# EAGLE design pannuhuone (EAGLE 5.06)
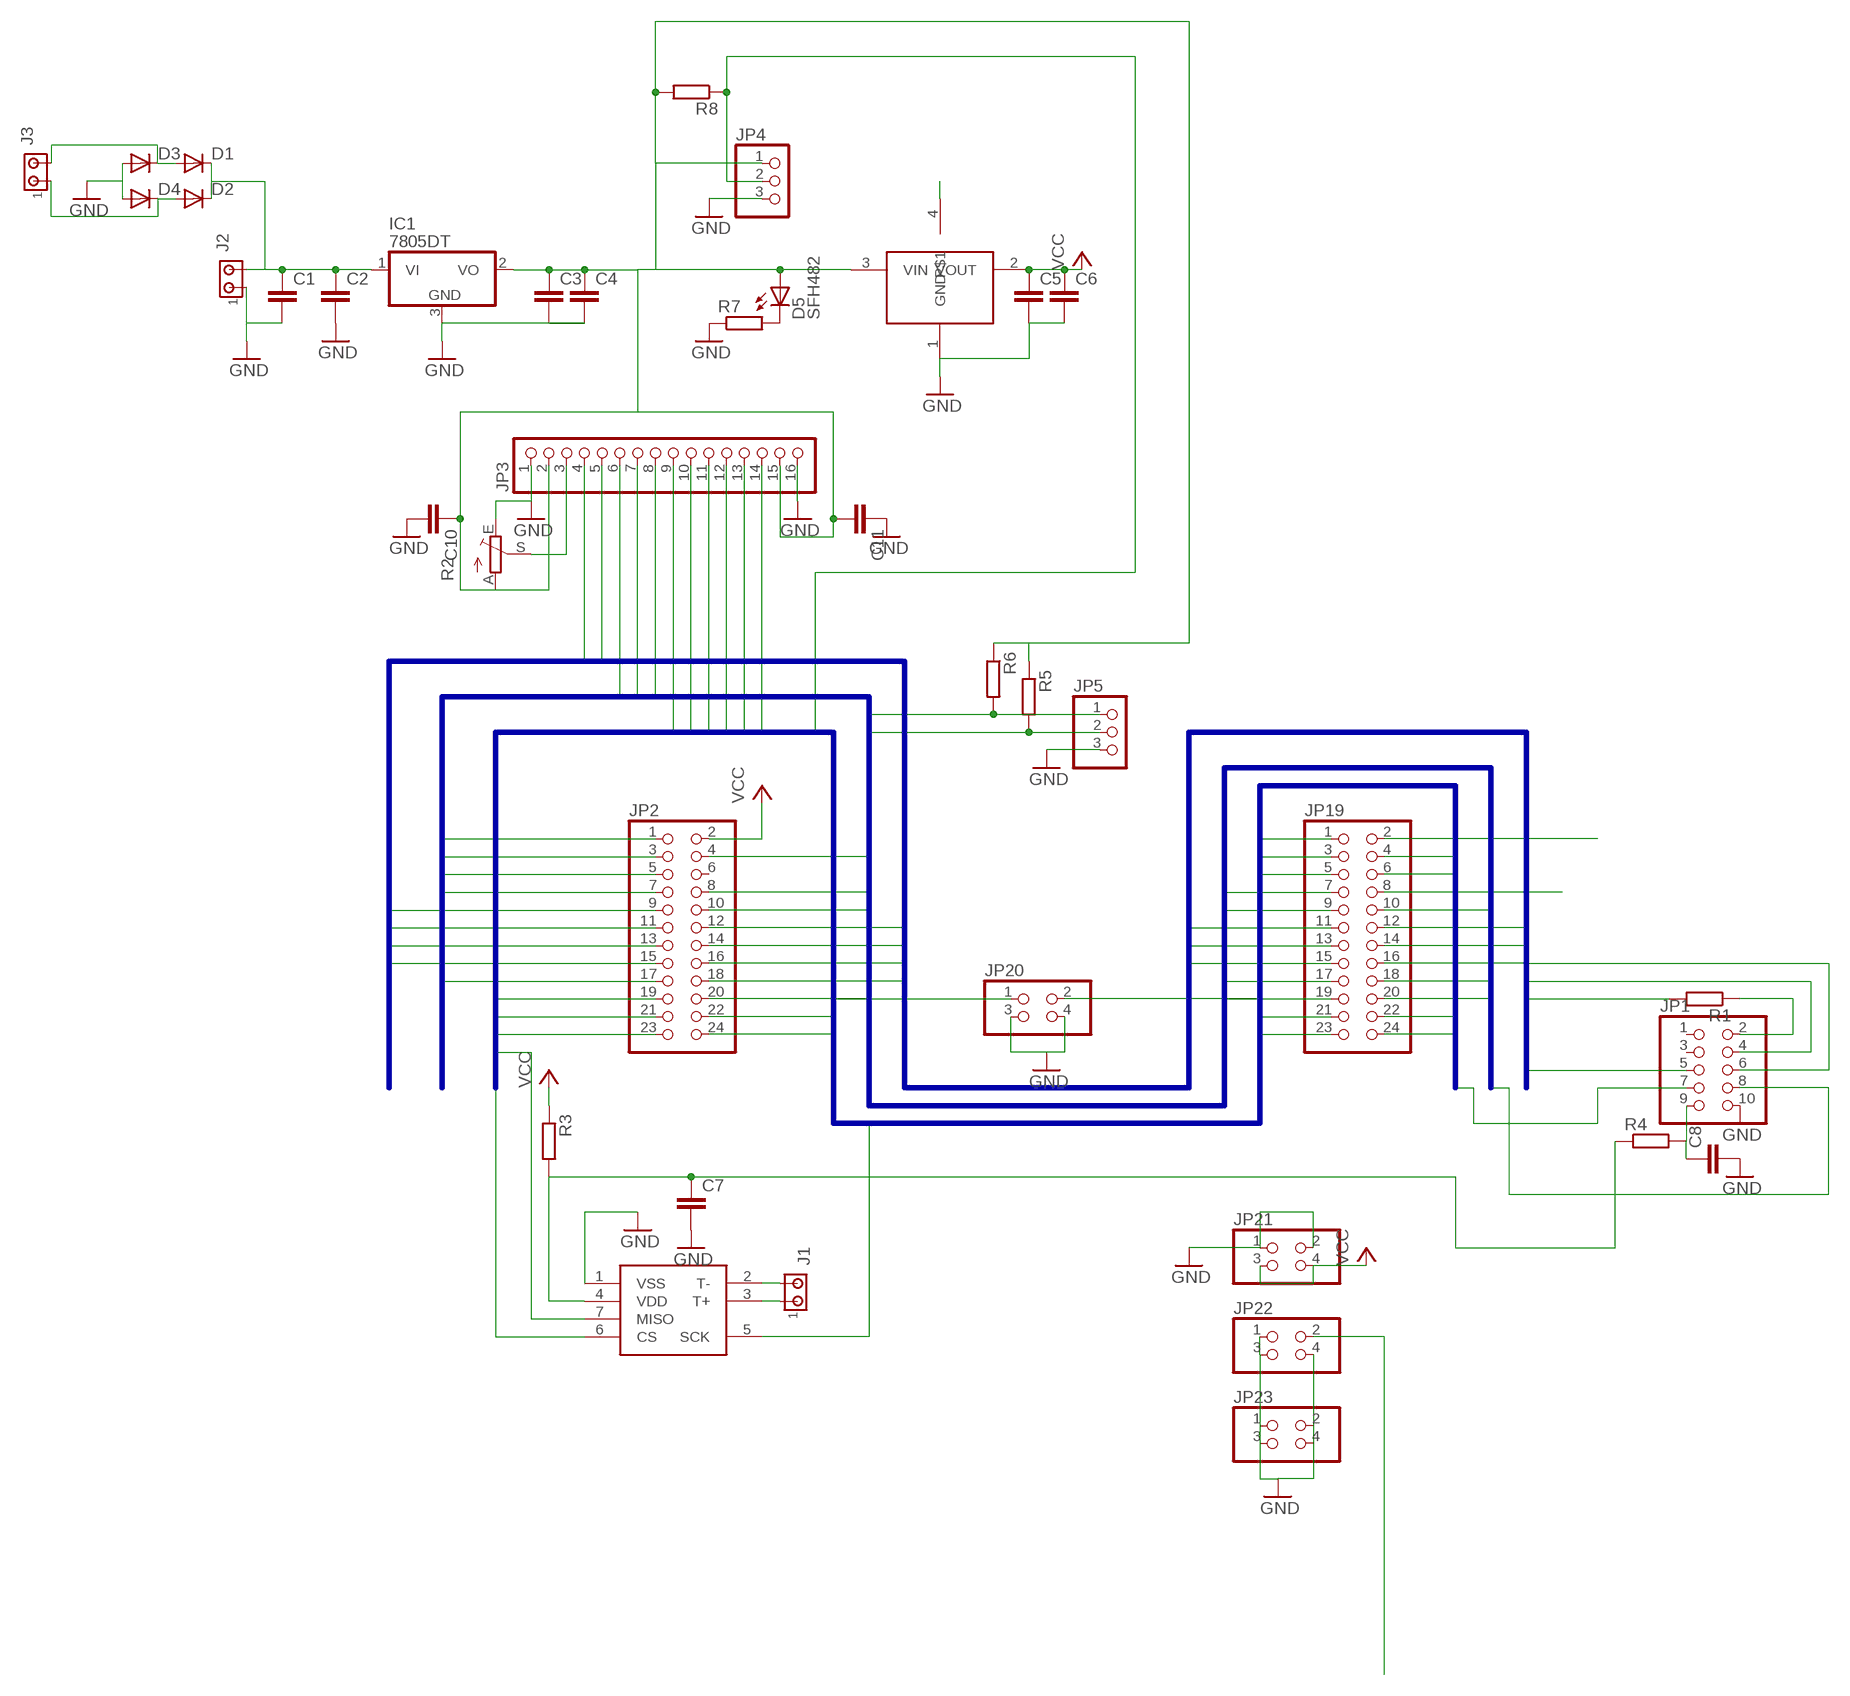
[diagram p0: schematic, sheet 1]

## Parts
C1  C-EU025-050X050  [C025-050X050]
C2  C-EUC1206  [C1206]
C3  C-EUC1206  [C1206]
C4  C-EUC1206  [C1206]
C5  C-EUC1206  [C1206]
C6  C-EUC1206  [C1206]
C7  C-EUC1206  [C1206]
C8  C-EUC1206  [C1206]
C10  C-EUC1206  [C1206]
C11  C-EUC1206  [C1206]
D1  DIODE-DO214AA  [DO214AA]
D2  DIODE-DO214AA  [DO214AA]
D3  DIODE-DO214AA  [DO214AA]
D4  DIODE-DO214AA  [DO214AA]
D5  SFH482  [SFH482]
IC1  7805DT  [TO252]
J1  MTA02-156  [1X2MTA]
J2  MTA02-156  [1X2MTA]
J3  MTA02-156  [1X2MTA]
JP1  PINHD-2X5  [2X05]
JP2  PINHD-2X12  [2X12]
JP3  PINHD-1X16  [1X16]
JP4  PINHD-1X3  [1X03]
JP5  PINHD-1X3  [1X03]
JP19  PINHD-2X12  [2X12]
JP20  PINHD-2X2  [2X02]
JP21  PINHD-2X2  [2X02]
JP22  PINHD-2X2  [2X02]
JP23  PINHD-2X2  [2X02]
R1  R-EU_R1206  [R1206]
R2  TRIM_EU-CA9V  [CA9V]
R3  R-EU_R1206  [R1206]
R4  R-EU_R5025  [R5025]
R5  R-EU_R1206  [R1206]
R6  R-EU_R1206  [R1206]
R7  R-EU_R1206  [R1206]
R8  R-EU_R1206  [R1206]
U$1  MAX6675  [SO08]
U$2  LD1117  [SOT223]

## Nets
GND: C1.2 C2.2 C3.2 C4.2 C5.2 C6.2 C7.2 C8.2 C10.2 C11.1 D3.A D4.A IC1.3(GND) J2.1 JP1.10 JP3.1 JP3.16 JP4.3 JP5.3 JP20.3 JP20.4 JP21.1 JP21.2 JP22.1 JP22.3 JP22.4 JP23.1 JP23.2 JP23.3 JP23.4 R2.E R7.1 U$1.1(VSS) U$2.1(GND)
N$1: JP1.2 R1.1
N$2: JP3.3 R2.S
N$3: J1.1 U$1.3(T+)
N$4: J1.2 U$1.2(T-)
N$5: C3.1 C4.1 C10.1 C11.2 D5.A IC1.2(VO) JP3.2 JP3.15 JP4.1 R2.A R5.1 R6.1 R8.2 U$2.3(VIN)
N$6: D5.K(C) R7.2
N$7: D1.A D3.C J3.2
N$8: C8.1 JP1.9 R4.2
N$9: C7.1 R3.2 R4.1 U$1.4(VDD)
N$10: D2.A D4.C J3.1
N$11: C1.1 C2.1 D1.C D2.C IC1.1(VI) J2.2
N$95: JP22.2
N$100: JP19.8
N$101: JP19.2
P$1: U$2.4
SPA0: JP2.9
SPA1: JP2.12
SPA2: JP2.11 R1.2
SPA3: JP2.14
SPA4: JP1.6 JP2.13
SPA5: JP2.16
SPA6: JP1.4 JP2.15
SPA7: JP1.5 JP2.18
SPA8: JP19.16
SPA9: JP19.15
SPA10: JP19.14
SPA13: JP19.13
SPA14: JP3.4 JP19.11
SPA15: JP3.5 JP19.12
SPB0: JP1.7 JP2.19
SPB1: JP2.22
SPB2: JP2.21
SPB3: JP3.9 JP19.5
SPB4: JP3.10 JP19.6
SPB5: JP19.3
SPB6: JP3.11 JP19.4
SPB7: JP3.12 JP19.1
SPB8: JP3.13 JP20.2
SPB9: JP3.14 JP20.1
SPB10: JP2.24
SPB11: JP2.23
SPB12: JP19.24 U$1.6(CS)
SPB13: JP19.23 U$1.5(SCK)
SPB14: JP19.22 U$1.7(MISO)
SPB15: JP4.2 JP19.21 R8.1
SPC0: JP2.5
SPC1: JP2.8
SPC2: JP2.7
SPC3: JP2.10
SPC4: JP1.8 JP2.17
SPC5: JP2.20
SPC6: JP19.20
SPC7: JP5.1 JP19.19 R6.2
SPC8: JP19.18
SPC9: JP5.2 JP19.17 R5.2
SPC10: JP3.6 JP19.9
SPC11: JP3.7 JP19.10
SPC12: JP3.8 JP19.7
SPC13: JP2.1
SPC14: JP2.4
SPC15: JP2.3
VCC: C5.1 C6.1 JP2.2 JP21.3 JP21.4 R3.1 U$2.2(VOUT)
Unconnected: JP1.1 JP1.3 JP2.6

## Buses
SPA[0..15]
SPC[0..15]
SPB[0..15]

## Library data of the parts
C1-C8 C10 C11 = rcl:C-EU: CAPACITOR, European symbol
D1-D4 = diode:DIODE-: DIODE
D5 = led:SFH482: IR LED infrared emitting diode, Infineon
IC1 = linear:78*: Positive VOLTAGE REGULATOR Source: http://cache.national.com/ds/LM/LM78L05.pdf http://www.fairchildsemi.com/ds/LM/LM7805.pdf
J1-J3 = con-amp:MTA02-156: AMP connector
JP1 = pinhead:PINHD-2X5: PIN HEADER
JP2 JP19 = pinhead:PINHD-2X12: PIN HEADER
JP3 = pinhead:PINHD-1X16: PIN HEADER
JP4 JP5 = pinhead:PINHD-1X3: PIN HEADER
JP20-JP23 = pinhead:PINHD-2X2: PIN HEADER
R1 R3-R8 = rcl:R-EU_: RESISTOR, European symbol
R2 = pot:TRIM_EU-: POTENTIOMETER
U$1 = max6675:MAX6675
U$2 = tommilib:LD1117

## Board
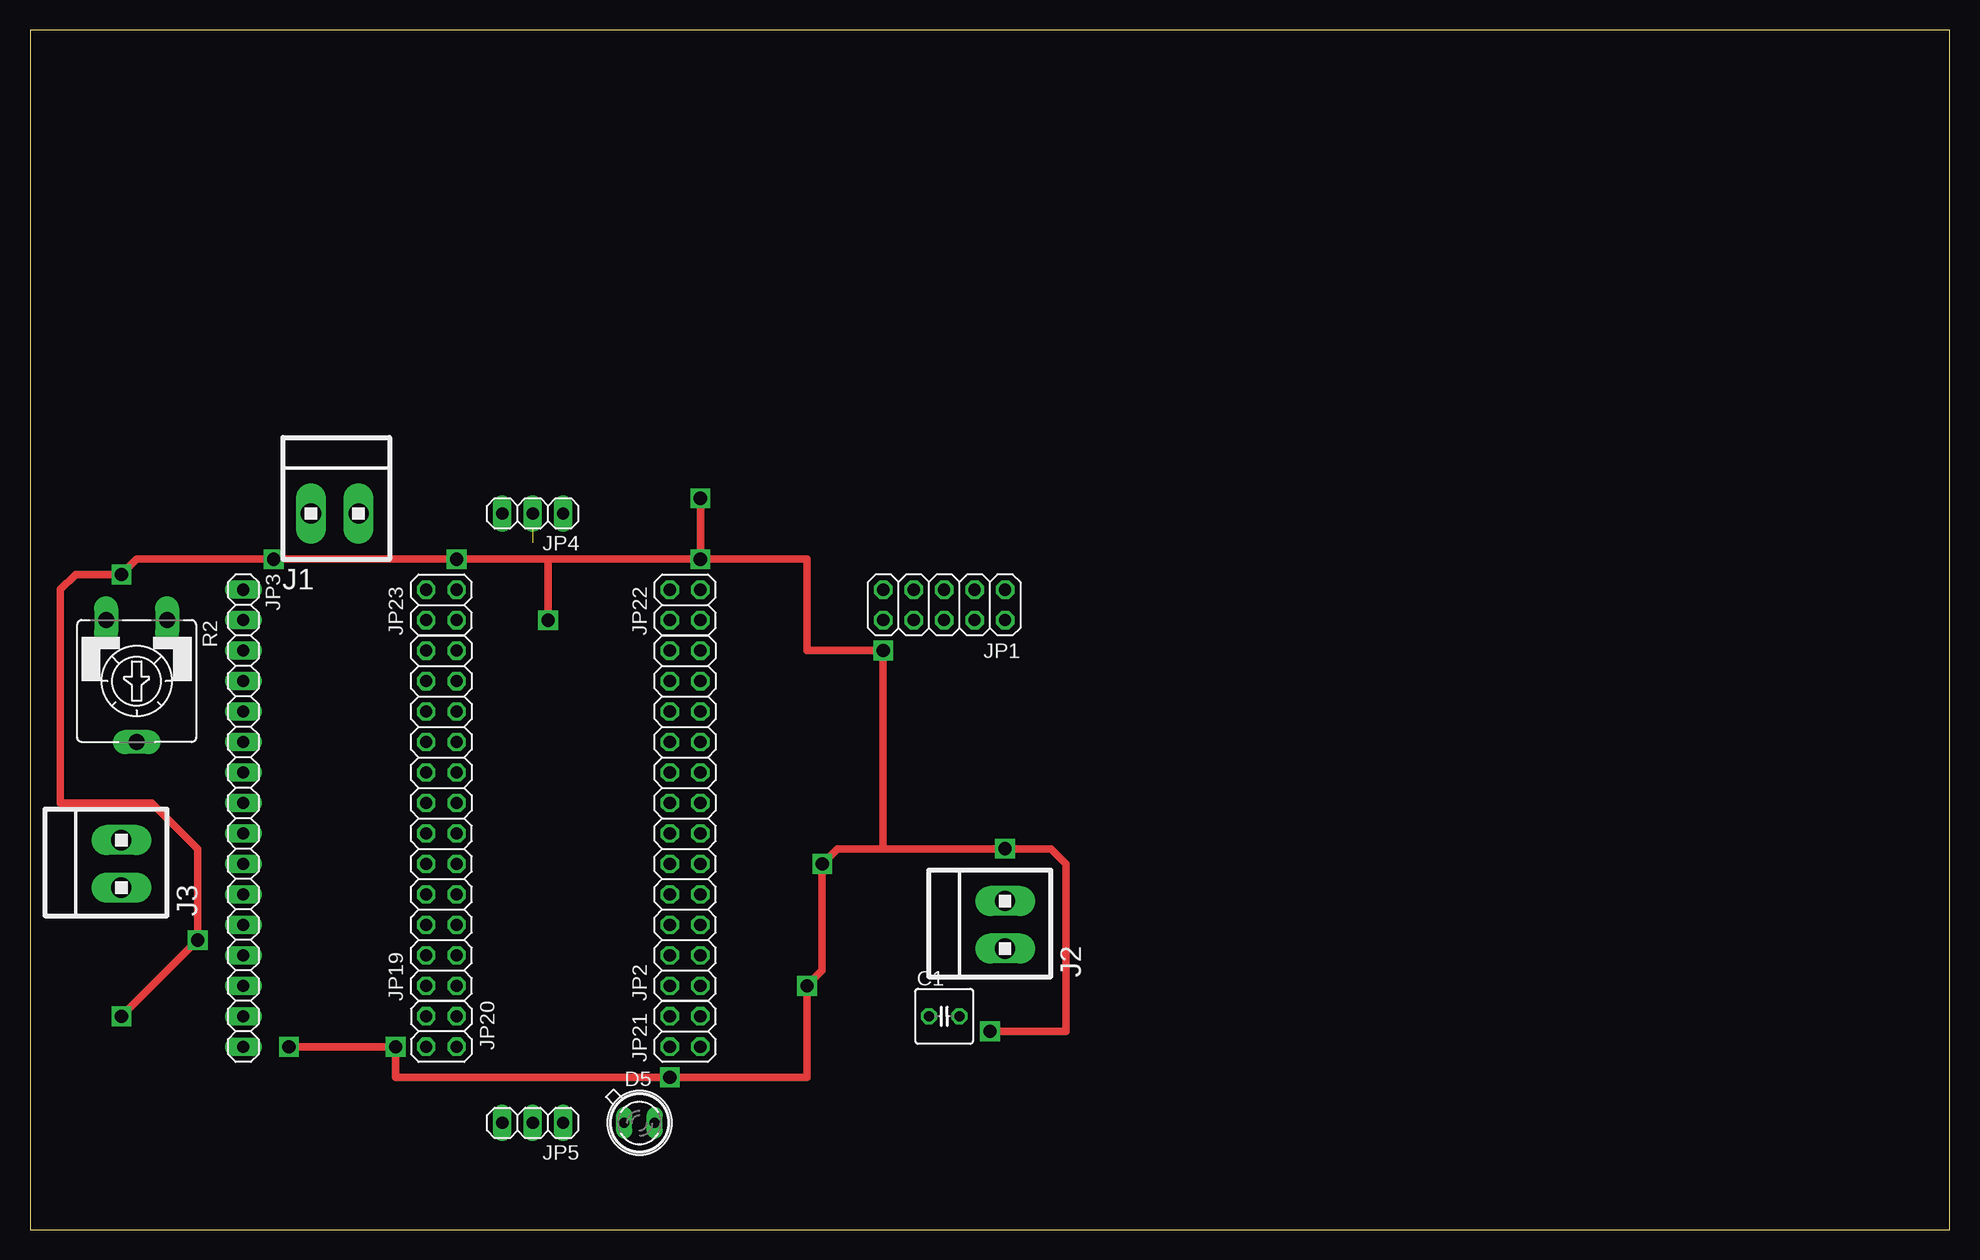
[diagram p1: board, top side]
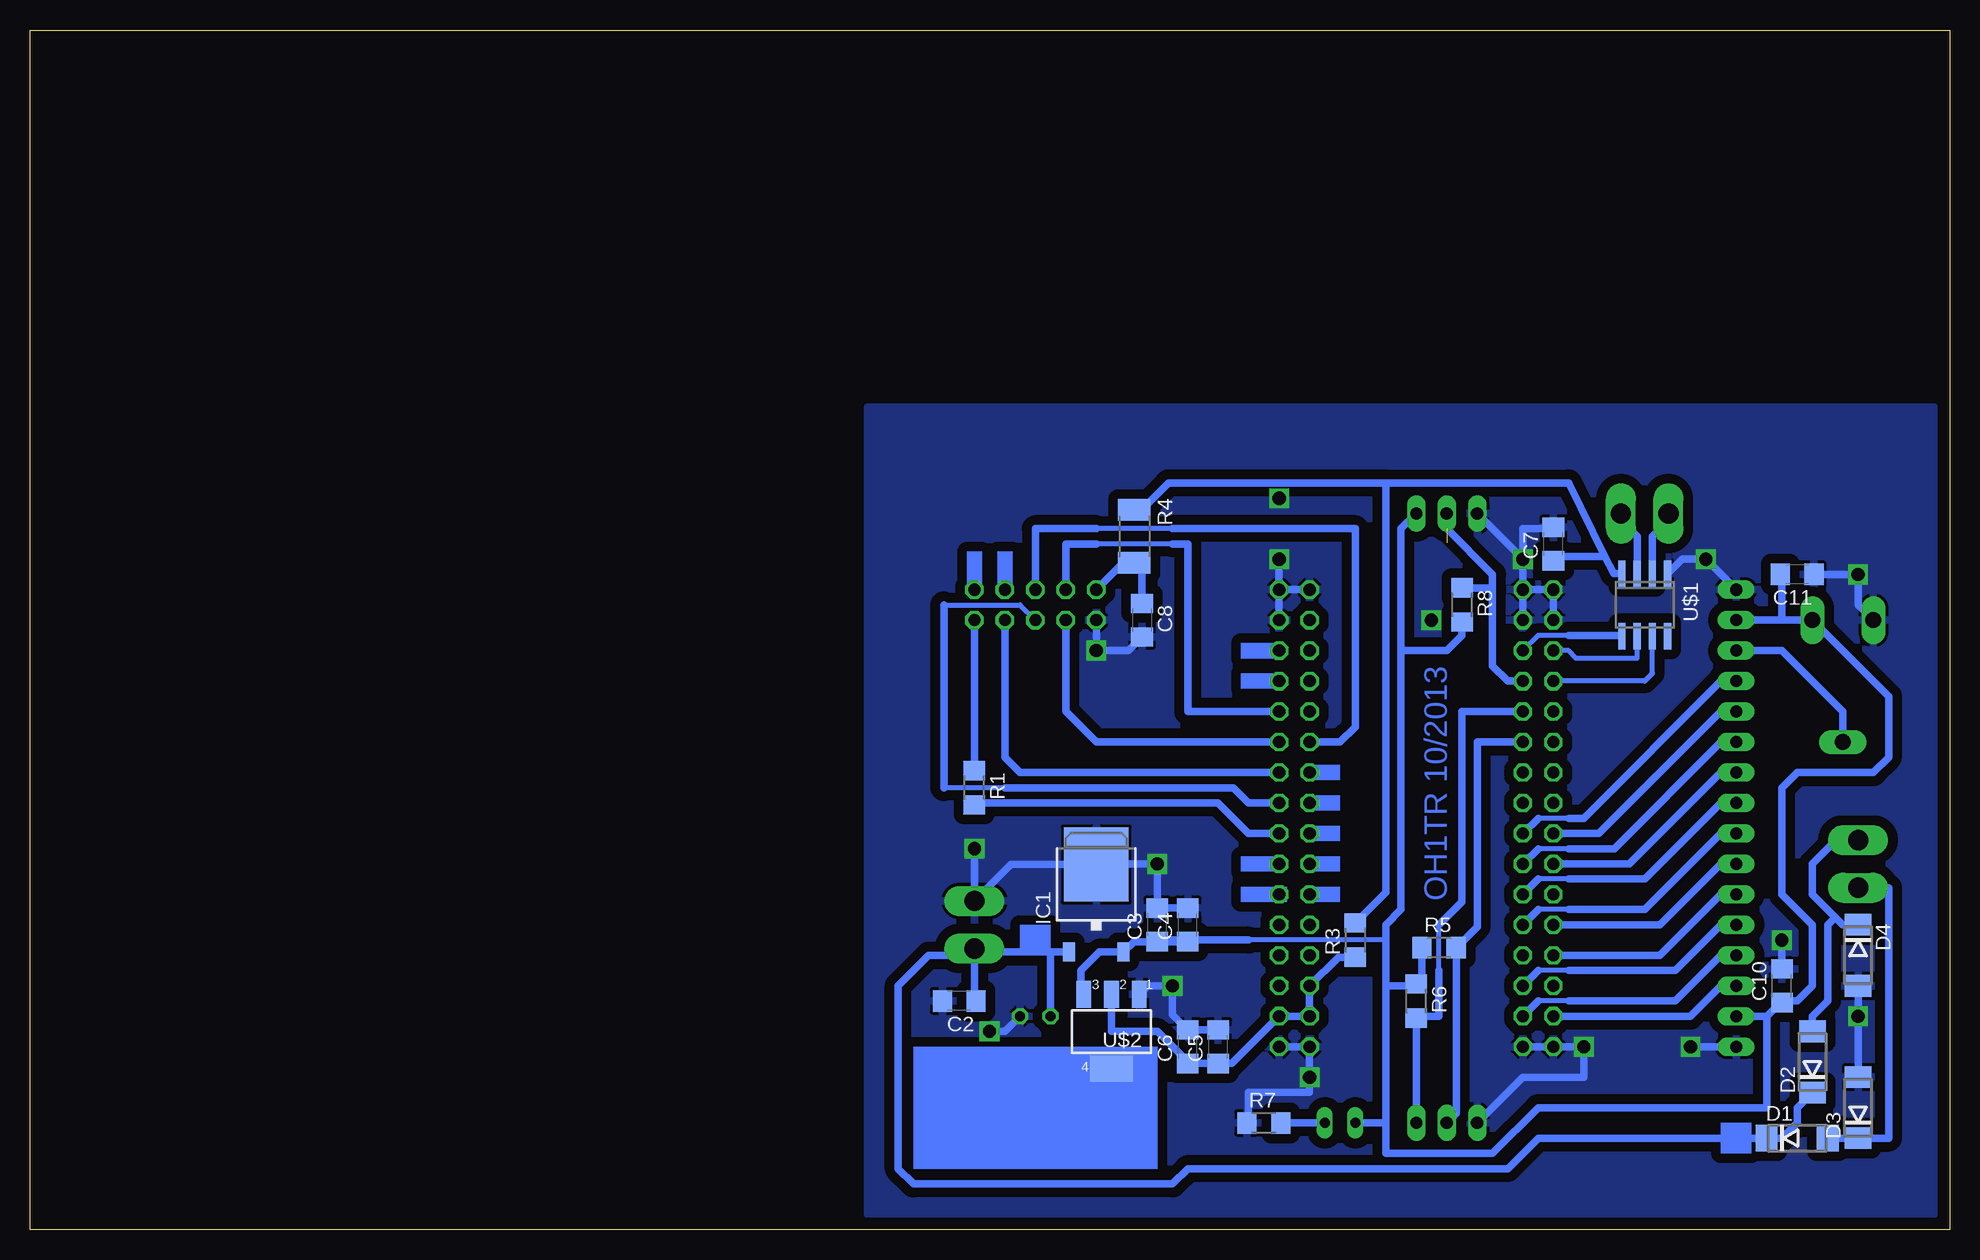
[diagram p2: board, bottom side, seen from below]

Size 160 x 100 mm. Coordinates in mm from the lower left corner, seen from the top.
Outline: 0,0 160,0 160,100 0,100 0,0
Copper layers (1*16): Top 0.035mm / dielectric 1.5mm / Bottom 0.035mm
Design rules "default": minimum track width 10mil, minimum drill 24mil, track to track 8mil, track to pad 8mil, pad to pad 8mil, via to via 8mil, smd to smd 8mil, copper to edge 40mil, drill to drill 8mil, minimum pad ring 10mil, minimum via ring 8mil, stop-mask expansion 4mil, vias tented up to drill 0mil, thermal gap 10mil

### Footprints (pad centres in the part's own frame; a part is rotated, then mirrored left to right if it is on the bottom)
C025-050X050 = drill 0.813 octagon: 1 -1.27,0; 2 1.27,0
C1206 = smd 1.6 x 1.8: 1 -1.4,0; 2 1.4,0
DO214AA = smd 1.8 x 2.2: A 2.55,0; C -2.55,0
SFH482 = drill 0.813 long: A -1.27,0; K 1.27,0
TO252 = smd 1 x 1.6: 1 -2.28,-4.8; 2 2.28,-4.8 | smd 5.4 x 6.2: 3 0,2.5
1X2MTA = drill 1.676 long: 1 1.981,0; 2 -1.981,0
2X05 = drill 1.016 octagon: 1 -5.08,-1.27; 2 -5.08,1.27; 3 -2.54,-1.27; 4 -2.54,1.27; 5 0,-1.27; 6 0,1.27; 7 2.54,-1.27; 8 2.54,1.27; 9 5.08,-1.27; 10 5.08,1.27
2X12 = drill 1.016 octagon: 1 -13.97,-1.27; 2 -13.97,1.27; 3 -11.43,-1.27; 4 -11.43,1.27; 5 -8.89,-1.27; 6 -8.89,1.27; 7 -6.35,-1.27; 8 -6.35,1.27; 9 -3.81,-1.27; 10 -3.81,1.27; 11 -1.27,-1.27; 12 -1.27,1.27; 13 1.27,-1.27; 14 1.27,1.27; 15 3.81,-1.27; 16 3.81,1.27; 17 6.35,-1.27; 18 6.35,1.27; 19 8.89,-1.27; 20 8.89,1.27; 21 11.43,-1.27; 22 11.43,1.27; 23 13.97,-1.27; 24 13.97,1.27
1X16 = drill 1.016 long: 1 -19.05,0; 2 -16.51,0; 3 -13.97,0; 4 -11.43,0; 5 -8.89,0; 6 -6.35,0; 7 -3.81,0; 8 -1.27,0; 9 1.27,0; 10 3.81,0; 11 6.35,0; 12 8.89,0; 13 11.43,0; 14 13.97,0; 15 16.51,0; 16 19.05,0
1X03 = drill 1.016 long: 1 -2.54,0; 2 0,0; 3 2.54,0
2X02 = drill 1.016 octagon: 1 -1.27,-1.27; 2 -1.27,1.27; 3 1.27,-1.27; 4 1.27,1.27
R1206 = smd 1.6 x 1.803: 1 -1.422,0; 2 1.422,0
CA9V = drill 1.321 long: A -2.54,-5.08; E 2.54,-5.08; S 0,5.08
R5025 = smd 1.8 x 2.7: 1 -2.2,0; 2 2.2,0
SO08 = smd 0.6 x 2.2: 1 -1.905,-2.6; 2 -0.635,-2.6; 3 0.635,-2.6; 4 1.905,-2.6; 5 1.905,2.6; 6 0.635,2.6; 7 -0.635,2.6; 8 -1.905,2.6
SOT223 = smd 1.219 x 2.235: 1 -2.311,-3.099; 2 0,-3.099; 3 2.311,-3.099 | smd 3.6 x 2.2: 4 0,3.099

### Placement (x,y rotation side)
C1  76.2,17.78 0 top
C2  82.55,19.05 180 bottom
C3  66.04,25.4 90 bottom
C4  63.5,25.4 90 bottom
C5  60.96,15.24 90 bottom
C6  63.5,15.24 90 bottom
C7  33.02,57.15 90 bottom
C8  67.31,50.8 270 bottom
C10  13.97,20.32 90 bottom
C11  12.7,54.61 180 bottom
D1  12.7,7.62 0 bottom
D2  11.43,13.97 90 bottom
D3  7.62,10.16 90 bottom
D4  7.62,22.86 270 bottom
D5  50.8,8.89 0 top
IC1  71.12,27.94 0 bottom
J1  25.4,59.69 0 top
J2  81.28,25.4 90 top
J3  7.62,30.48 90 top
JP1  76.2,52.07 180 top
JP2  54.61,34.29 90 top
JP3  17.78,34.29 270 top
JP4  41.91,59.69 180 top
JP5  41.91,8.89 180 top
JP19  34.29,34.29 90 top
JP20  34.29,16.51 270 top
JP21  54.61,16.51 90 top
JP22  54.61,52.07 90 top
JP23  34.29,52.07 90 top
R1  81.28,36.83 270 bottom
R2  8.89,45.72 180 top
R3  49.53,24.13 90 bottom
R4  67.94,57.78 270 bottom
R5  42.55,23.5 0 bottom
R6  44.45,19.05 270 bottom
R7  57.15,8.89 0 bottom
R8  40.64,52.07 270 bottom
U$1  25.4,52.07 180 bottom
U$2  69.85,16.51 180 bottom

### Tracks (layer width: path | path; a pad name or v marks a point on that pad's centre or on a via)
GND  (via drill 1.1)
  Top 0.61: v80.01,16.51 86.36,16.51 86.36,30.48 85.09,31.75 v81.28,31.75 71.12,31.75 | 71.12,31.75 67.31,31.75 v66.04,30.48 66.04,21.59 v64.77,20.32 64.77,12.7 v53.34,12.7 30.48,12.7 v30.48,15.24 v21.59,15.24 | 71.12,31.75 v71.12,48.26 64.77,48.26 64.77,55.88 v55.88,55.88 | 43.18,55.88 v55.88,55.88 | 43.18,55.88 v35.56,55.88 v20.32,55.88 8.89,55.88 v7.62,54.61 3.81,54.61 2.54,53.34 2.54,35.56 10.16,35.56 13.97,31.75 v13.97,24.13 v7.62,17.78 | v55.88,55.88 v55.88,60.96 | 43.18,55.88 v43.18,50.8
  Bottom 0.61: C4.2 C3.2 v66.04,30.48 71.08,30.48 IC1.3 78.22,30.44 J2.1 v81.28,31.75 | C5.2 C6.2 64.77,17.91 v64.77,20.32 66.83,20.32 U$2.1 | C1.2 78.74,16.51 v80.01,16.51 | JP1.10 v71.12,48.26 68.45,48.26 C8.2 | JP22.3 JP22.4 | JP22.3 JP22.1 | v55.88,55.88 JP22.3 | JP21.1 JP21.2 v53.34,12.7 53.34,11.43 58.42,11.43 58.42,8.89 R7.1 | v21.59,15.24 JP3.16 | JP23.2 JP23.4 JP23.3 | JP23.3 JP23.1 | v35.56,55.88 JP23.3 | U$1.1 22.29,55.88 v20.32,55.88 JP3.1 | R2.E 7.62,52.07 v7.62,54.61 C11.1 | v35.56,55.88 JP4.3 | C7.2 33.15,58.42 35.56,58.42 v35.56,55.88 | v13.97,24.13 C10.2 | JP20.4 JP20.3 v30.48,15.24 30.48,12.7 35.56,12.7 JP5.3 | D4.A v7.62,17.78 D3.A
  pour Bottom (isolate 0.813): 1.27,68.58 90.17,68.58 90.17,1.27 1.27,1.27
N$1
  Bottom 0.61: R1.1 JP1.2
N$2
  Bottom 0.61: JP3.3 13.97,48.26 8.89,43.18 R2.S
N$3
  Bottom 0.61: U$1.3 26.04,57.78 27.38,59.13 J1.1
N$4
  Bottom 0.61: U$1.2 24.77,57.78 23.42,59.13 J1.2
N$5
  Bottom 0.406: 46.99,24.13 58.42,24.13
  Bottom 0.61: 13.97,50.8 R2.A 5.08,44.45 5.08,39.37 6.35,38.1 12.7,38.1 13.97,36.83 13.97,27.94 11.43,25.4 11.43,20.32 12.7,19.05 13.84,19.05 C10.1 14.1,18.92 15.24,17.78 | 13.97,50.8 JP3.2 | C3.1 C4.1 63.5,24.13 | C3.1 65.91,24.13 63.5,24.13 | U$2.3 72.39,19.84 72.39,21.59 70.84,23.14 IC1.2 67.98,24 C3.1 | 15.24,17.78 JP3.15 | 46.99,8.89 46.99,6.35 38.1,6.35 34.29,10.16 15.24,10.16 15.24,17.78 | 46.99,8.89 46.99,20.32 | 46.99,20.32 46.99,24.13 46.99,25.4 45.72,26.67 45.72,48.26 | 58.42,24.13 63.5,24.13 | JP4.1 45.72,58.42 45.72,48.26 | C11.2 13.97,54.48 13.97,50.8 | 46.99,20.32 44.6,20.32 R6.1 43.97,20.95 R5.1 | 46.99,8.89 D5.A | R8.2 40.64,49.53 41.91,48.26 45.72,48.26
N$6
  Bottom 0.61: D5.K R7.2
N$7
  Bottom 0.61: D1.A D3.C 5.08,7.62 5.08,28.5 J3.2
N$8
  Bottom 0.61: JP1.9 68.88,55.59 R4.2 67.31,54.95 C8.1
N$9
  Bottom 0.61: R4.1 67.65,59.69 65.11,62.23 46.99,62.23 | 46.99,62.23 31.75,62.23 28.72,56.12 | 28.72,56.12 28,54.67 U$1.4 | R3.2 46.99,28.09 46.99,62.23 | C7.1 32.65,56.12 28.72,56.12
N$10
  Bottom 0.61: J3.1 9.45,32.46 11.43,30.48 11.43,27.94 9.53,26.04 | 9.53,26.04 8.89,25.4 D4.C | D2.A 11.43,17.78 10.16,19.05 10.16,25.4 9.53,26.04
N$11
  Bottom 0.61: 74.92,17.79 C1.1 74.93,23.14 | C2.1 81.28,19.18 81.28,22.86 | 81.28,22.86 J2.2 81,23.14 74.93,23.14 | 74.93,23.14 IC1.1 | D2.C 12.7,10.15 12.7,8.89 13.97,7.62 D1.C 34.29,7.62 36.83,5.08 63.5,5.08 64.77,3.81 86.36,3.81 87.63,5.08 87.63,20.32 85.09,22.86 81.28,22.86
SPA2
  Bottom 0.61: JP2.11 58.42,33.02 60.96,35.56 81.13,35.56 R1.2
SPA4
  Bottom 0.406: 83.82,52.07 77.47,52.07 JP1.6 | 78.74,36.83 83.82,36.83
  Bottom 0.61: 83.82,36.83 83.82,52.07 | 78.74,36.83 59.69,36.83 58.42,35.56 JP2.13
SPA6
  Bottom 0.61: JP2.15 77.47,38.1 78.74,39.37 JP1.4
SPA7
  Bottom 0.406: 64.77,58.42 71.12,58.42
  Bottom 0.61: JP1.5 76.2,58.42 71.12,58.42 | JP2.18 50.8,40.64 49.53,41.91 49.53,58.42 64.77,58.42
SPA14
  Bottom 0.406: 31.75,34.29 34.29,34.29
  Bottom 0.61: 34.29,34.29 JP19.11 | JP3.4 19.05,45.72 30.48,34.29 31.75,34.29
SPA15
  Bottom 0.61: JP19.12 29.21,33.02 19.05,43.18 JP3.5
SPB0
  Bottom 0.406: 64.77,57.15 71.12,57.15
  Bottom 0.61: JP1.7 73.66,57.15 71.12,57.15 | JP2.19 63.5,43.18 63.5,57.15 64.77,57.15
SPB3
  Bottom 0.406: 31.75,26.67 34.29,26.67
  Bottom 0.61: 34.29,26.67 JP19.5 | JP3.9 19.05,33.02 25.4,26.67 31.75,26.67
SPB4
  Bottom 0.61: JP3.10 19.05,30.48 24.13,25.4 JP19.6
SPB6
  Bottom 0.61: JP3.11 19.05,27.94 24.13,22.86 JP19.4
SPB7
  Bottom 0.406: 31.75,21.59 34.29,21.59
  Bottom 0.61: 34.29,21.59 JP19.1 | JP3.12 19.05,25.4 22.86,21.59 31.75,21.59
SPB8
  Bottom 0.406: 31.75,19.05 34.29,19.05
  Bottom 0.61: 34.29,19.05 JP20.2 | JP3.13 19.05,22.86 22.86,19.05 31.75,19.05
SPB9
  Bottom 0.61: JP20.1 21.59,17.78 19.05,20.32 JP3.14
SPB12
  Bottom 0.406: U$1.6 26.04,47.62 31.11,47.62 31.75,48.26 JP19.24
SPB13
  Bottom 0.406: 31.75,49.53 34.29,49.53 JP19.23
  Bottom 0.61: U$1.5 27.36,49.53 31.75,49.53
SPB14
  Bottom 0.406: U$1.7 24.77,46.35 25.4,45.72 JP19.22
SPB15  (1 unrouted)
  Bottom 0.61: JP4.2 41.91,58.42 38.1,54.61 38.1,53.34 | 38.1,53.34 38.1,46.99 36.83,45.72 JP19.21 | R8.1 38.1,53.49 38.1,53.34
SPC4
  Bottom 0.61: JP1.8 73.66,43.18 71.12,40.64 JP2.17
SPC7
  Bottom 0.406: 42.55,21.59 42.55,25.4
  Bottom 0.61: JP5.1 R6.2 44.3,17.78 42.55,17.78 42.55,21.59 | JP19.19 40.64,43.18 40.64,27.3 42.55,25.4
SPC9
  Bottom 0.61: JP19.17 39.37,40.64 39.37,25.25 R5.2 41.12,9.68 JP5.2
SPC10
  Bottom 0.406: 31.75,31.75 34.29,31.75
  Bottom 0.61: 34.29,31.75 JP19.9 | JP3.6 19.05,40.64 27.94,31.75 31.75,31.75
SPC11
  Bottom 0.61: JP19.10 26.67,30.48 19.05,38.1 JP3.7
SPC12
  Bottom 0.406: 31.75,29.21 34.29,29.21
  Bottom 0.61: 34.29,29.21 JP19.7 | JP3.8 19.05,35.56 25.4,29.21 31.75,29.21
VCC
  Bottom 0.61: U$2.2 69.85,16.51 66.04,16.51 63.5,13.97 | 63.5,13.97 C6.1 | 63.5,13.97 63.37,13.84 C5.1 59.82,13.84 JP21.3 JP21.4 JP2.2 50.95,22.71 R3.1
(copper drawn outside any net)
  shapes: Bottom area x14

### Text on the board
Bottom: OH1TR 10/2013